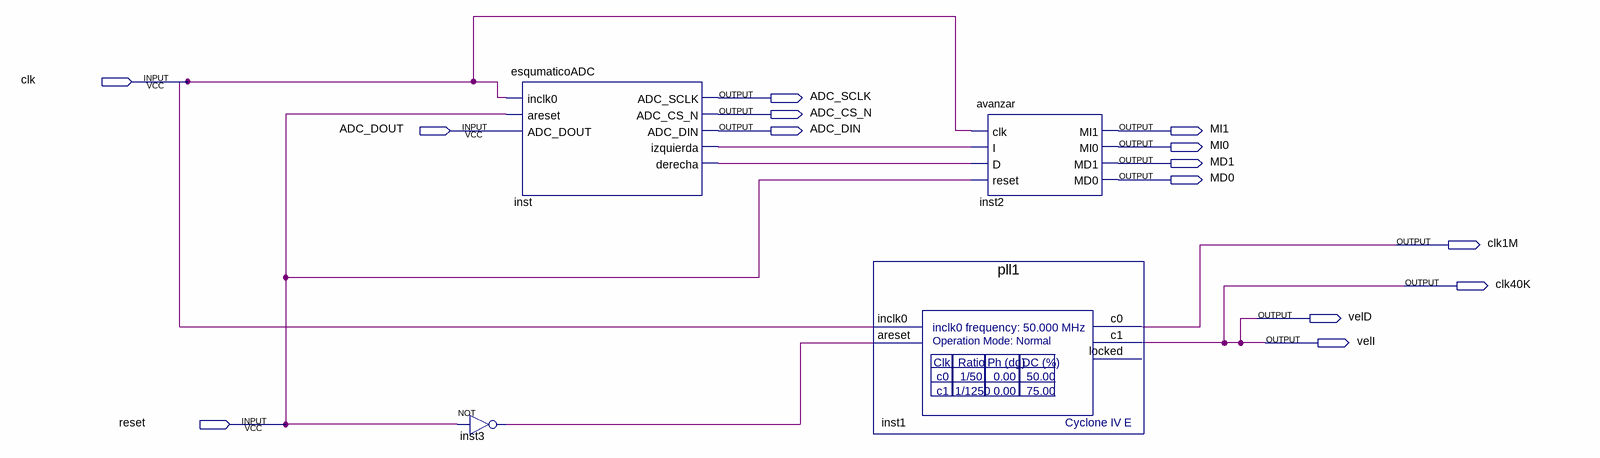
[diagram p0: schematic sheet]
// Quartus schematic derecho.bdf as structural Verilog: 4 symbols, 14 pins
module derecho (
  input  clk,
  input  ADC_DOUT,
  input  reset,
  output ADC_SCLK,
  output ADC_CS_N,
  output ADC_DIN,
  output MI1,
  output MI0,
  output MD1,
  output MD0,
  output clk1M,
  output clk40K,
  output velD,
  output velI
);

  wire inst3_out, inst_derecha, inst_izquierda;

  not inst3 (inst3_out, reset);
  esqumaticoADC inst (
    .inclk0(clk), .areset(reset), .ADC_DOUT(ADC_DOUT), .ADC_SCLK(ADC_SCLK), .ADC_CS_N(ADC_CS_N),
    .ADC_DIN(ADC_DIN), .izquierda(inst_izquierda), .derecha(inst_derecha));
  pll1 inst1 (.inclk0(clk), .areset(inst3_out), .c0(clk1M), .c1(clk40K));  // open: locked
  avanzar inst2 (
    .clk(clk), .I(inst_izquierda), .D(inst_derecha), .reset(reset), .MI1(MI1), .MI0(MI0), .MD1(MD1), .MD0(MD0));

  assign velD = clk40K;
  assign velI = clk40K;
endmodule
